# EasyEDA schematic sensor-shield-v5.json

## Sheets
1 Sensors: TITLE: Sheet_1; REV: 1.0; Date: 2022-08-30; Sheet: 1/1; Drawn By: lonelycorn; Company: Your Company
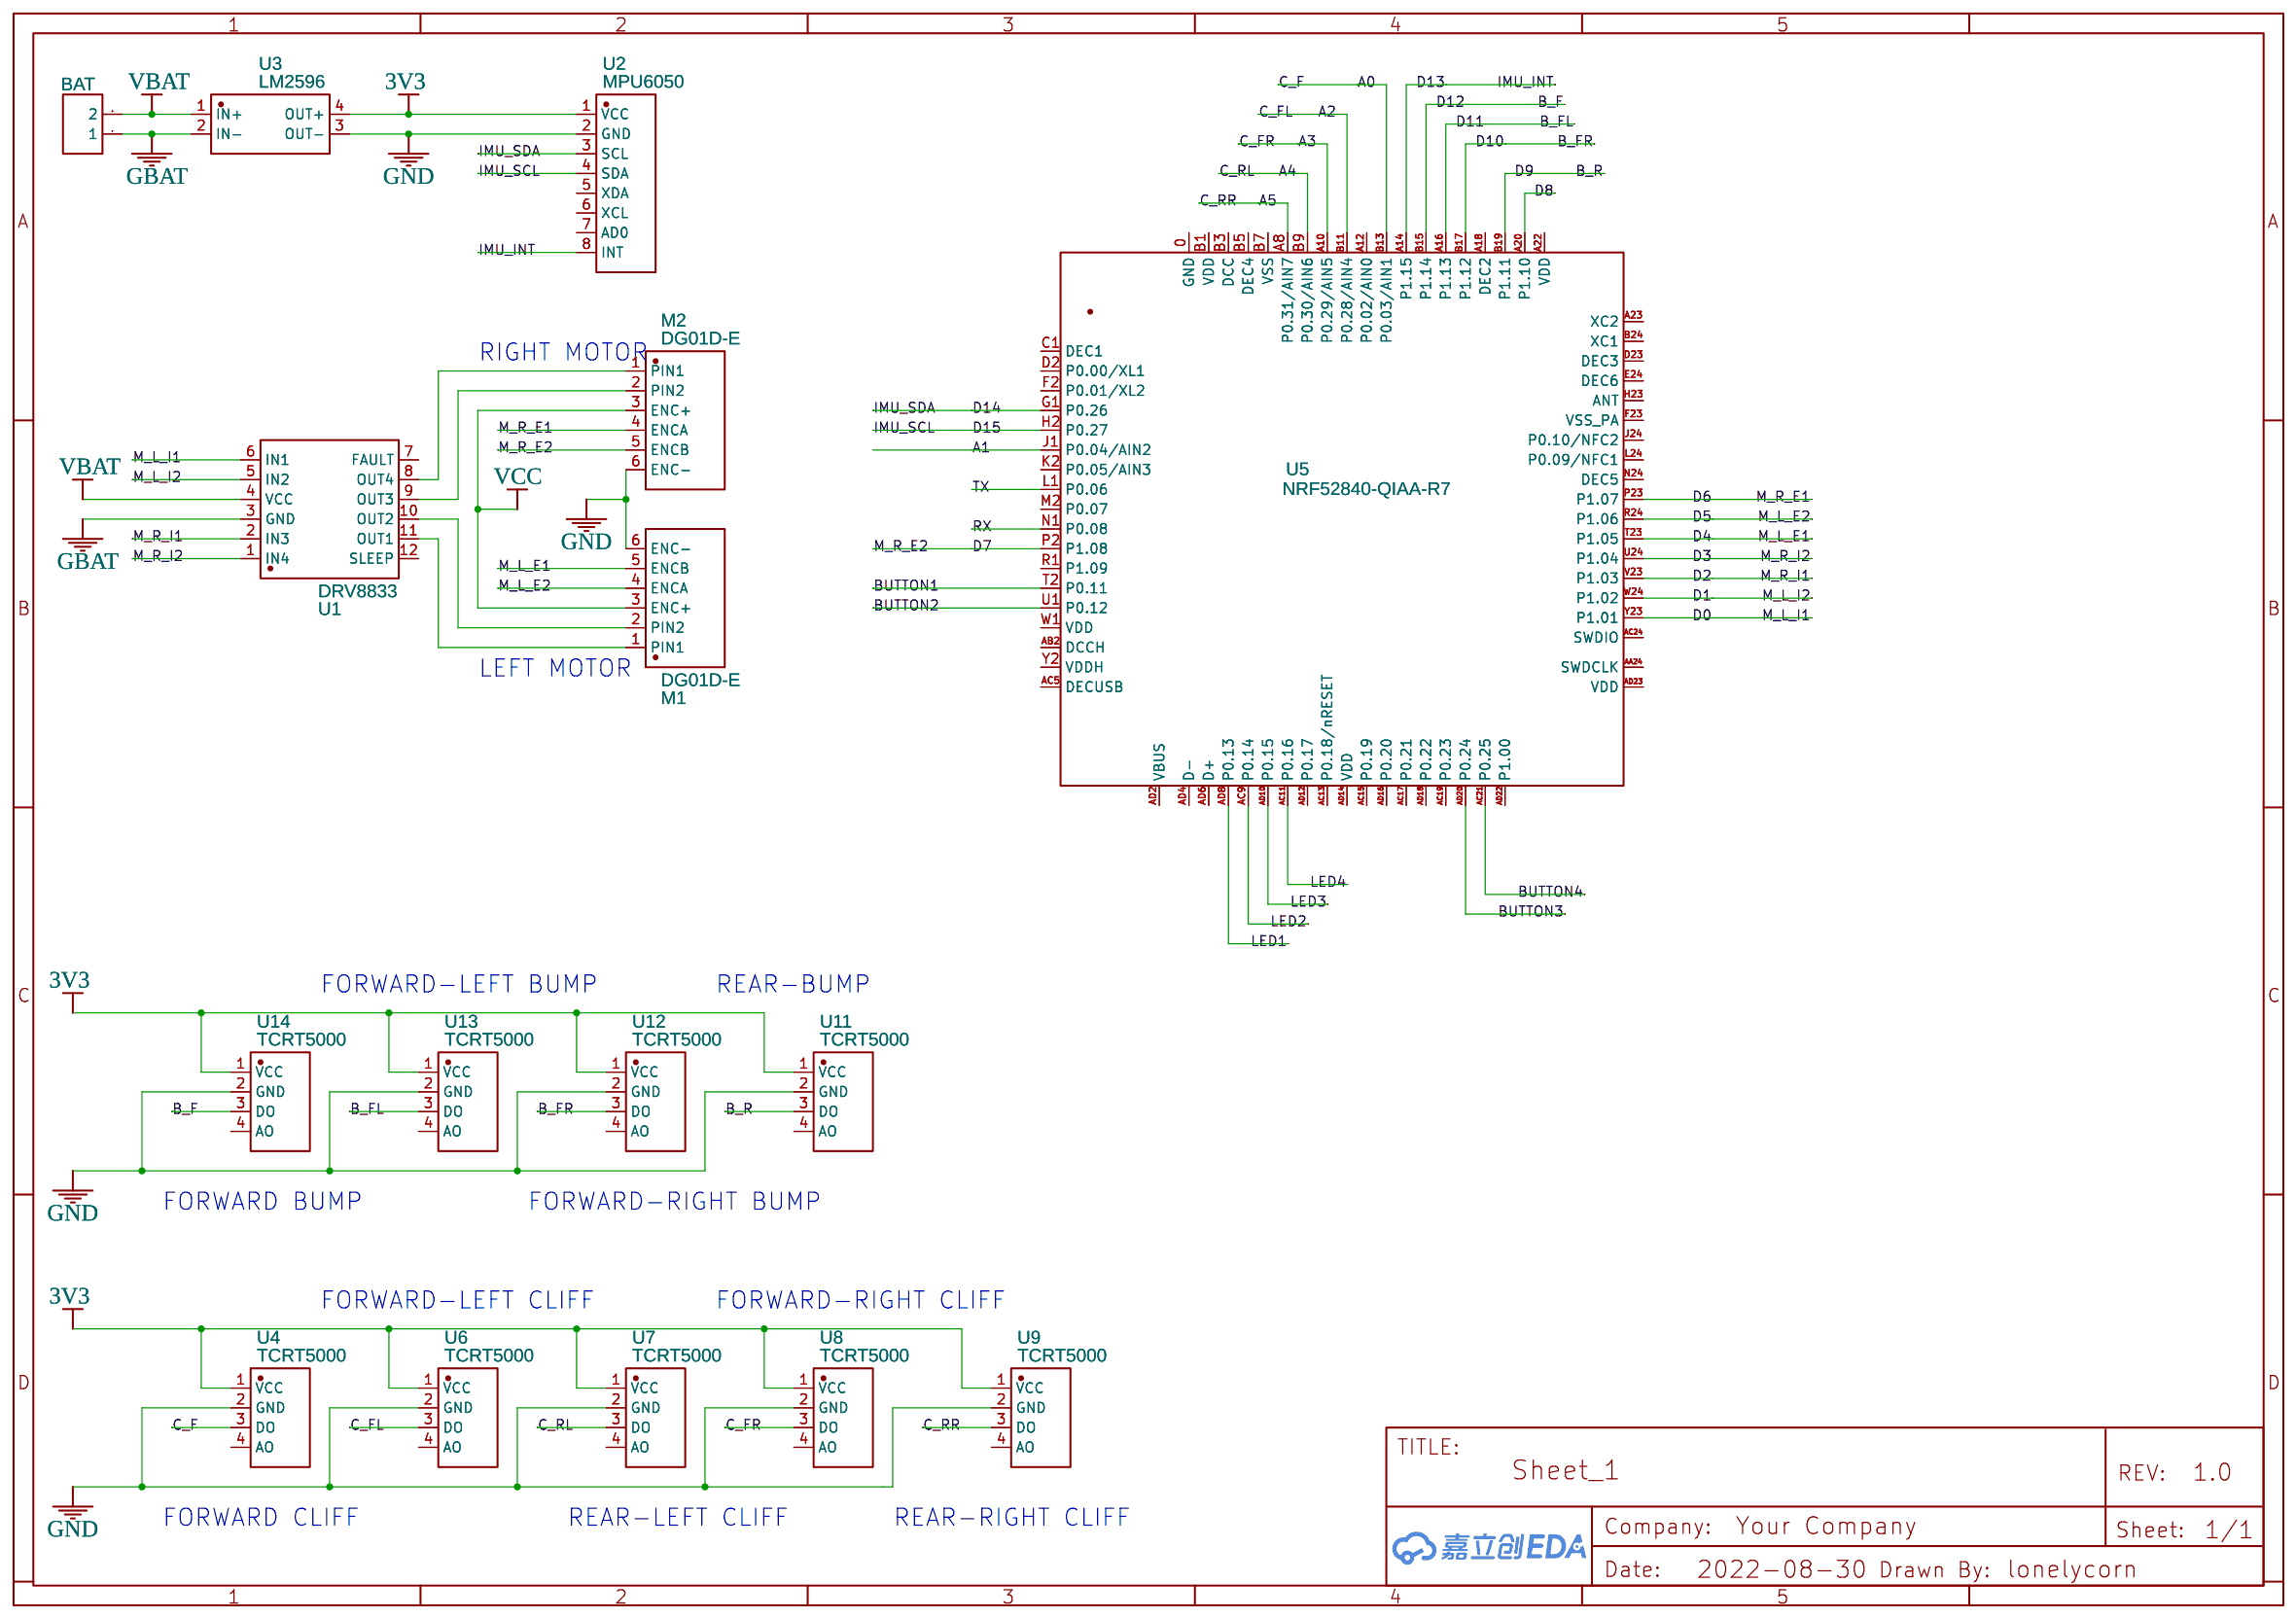
[diagram p0: Sensors]
2 Sensor Shield v5.0: TITLE: UNO Sensor Shield V5.0; Date: 2022-09-05
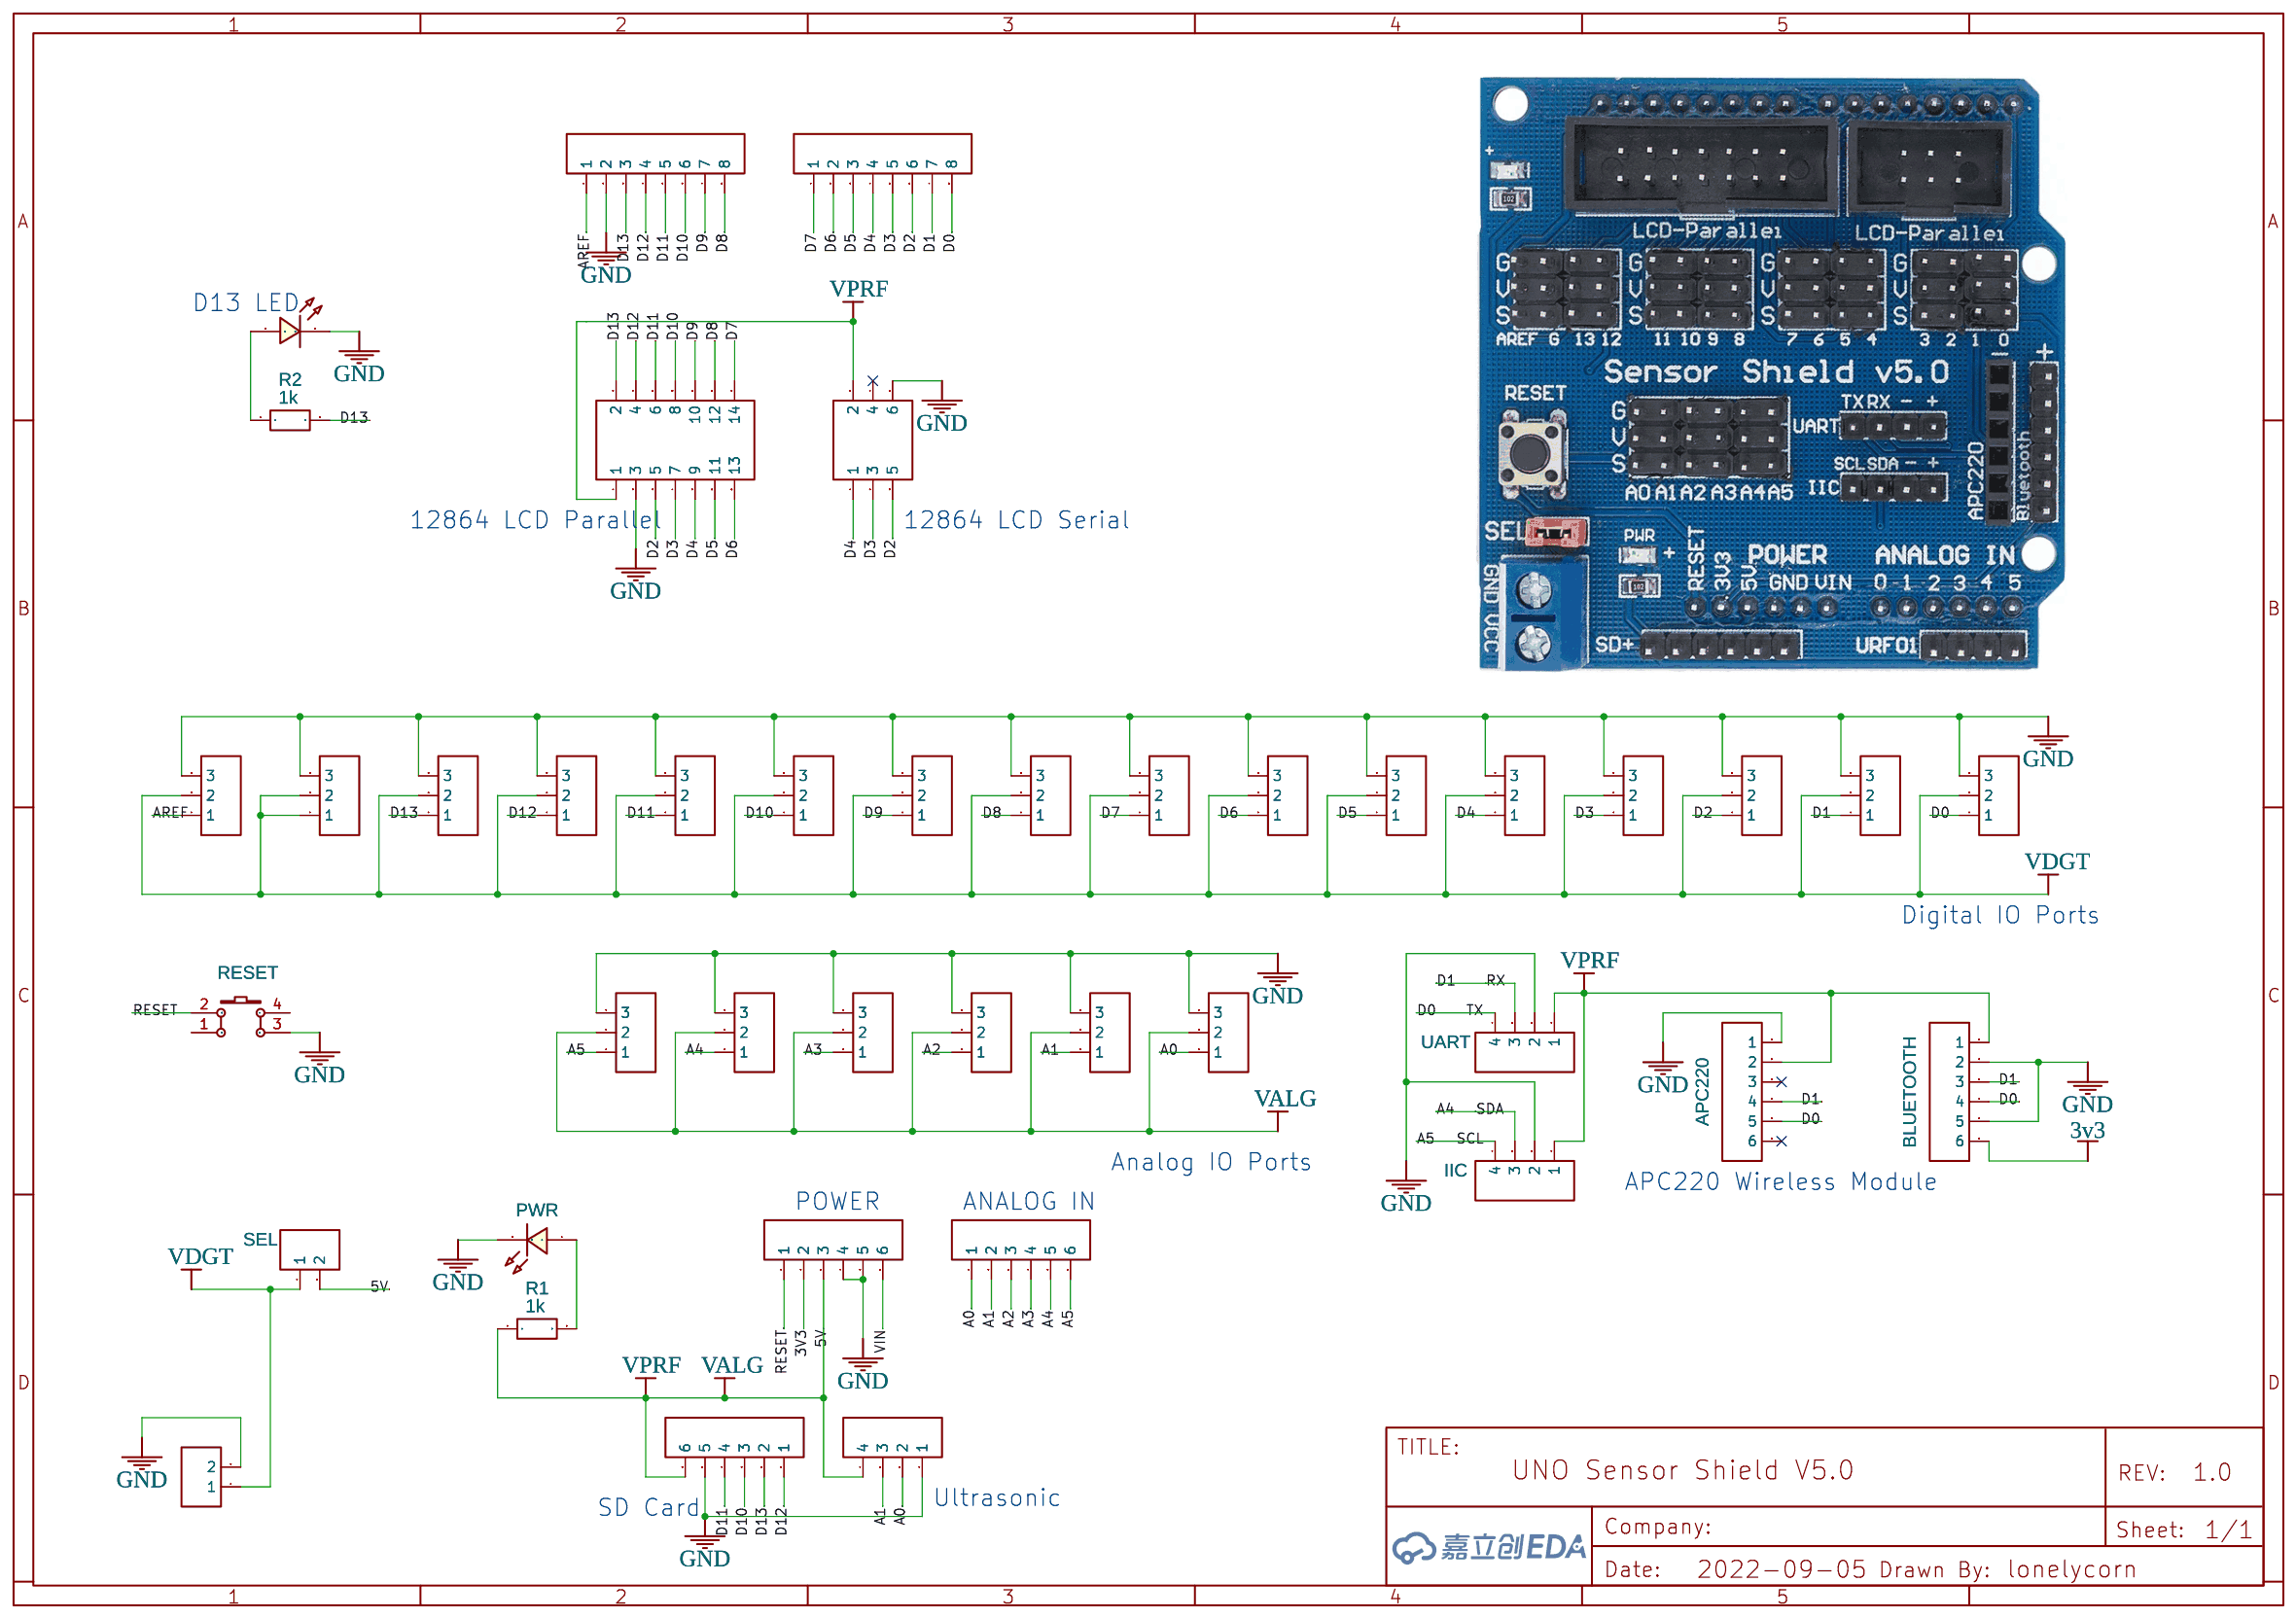
[diagram p1: Sensor Shield v5.0]

## Parts
sheet Sensor Shield v5.0
APC220  HDR-F-2.54_1x6  [HDR-F-2.54_1X6]
BLUETOOTH  HDR-M-2.54_1x6  [HDR-M-2.54_1X6]
D0  HDR-M-2.54_1x3  [HDR-M-2.54_1X3]
D1  HDR-M-2.54_1x3  [HDR-M-2.54_1X3]
D2  HDR-M-2.54_1x3  [HDR-M-2.54_1X3]
D3  HDR-M-2.54_1x3  [HDR-M-2.54_1X3]
D4  HDR-M-2.54_1x3  [HDR-M-2.54_1X3]
D5  HDR-M-2.54_1x3  [HDR-M-2.54_1X3]
D6  HDR-M-2.54_1x3  [HDR-M-2.54_1X3]
D7  HDR-M-2.54_1x3  [HDR-M-2.54_1X3]
D8  HDR-M-2.54_1x3  [HDR-M-2.54_1X3]
D9  HDR-M-2.54_1x3  [HDR-M-2.54_1X3]
D10  HDR-M-2.54_1x3  [HDR-M-2.54_1X3]
D11  HDR-M-2.54_1x3  [HDR-M-2.54_1X3]
D12  HDR-M-2.54_1x3  [HDR-M-2.54_1X3]
D13  HDR-M-2.54_1x3  [HDR-M-2.54_1X3]
D14  HDR-M-2.54_1x3  [HDR-M-2.54_1X3]
D15  HDR-M-2.54_1x3  [HDR-M-2.54_1X3]
D16  HDR-M-2.54_1x3  [HDR-M-2.54_1X3]
D17  HDR-M-2.54_1x3  [HDR-M-2.54_1X3]
D18  HDR-M-2.54_1x3  [HDR-M-2.54_1X3]
D19  HDR-M-2.54_1x3  [HDR-M-2.54_1X3]
H1  HDR-M-2.54_1x3  [HDR-M-2.54_1X3]
H2  HDR-M-2.54_1x3  [HDR-M-2.54_1X3]
H4  HDR-F-2.54_2x3  [HDR-F-2.54_2X3]
IIC  HDR-M-2.54_1x4  [HDR-M-2.54_1X4]
J1  HDR-M-2.54_1x8  [HDR-M-2.54_1X8]
J2  HDR-M-2.54_1x8  [HDR-M-2.54_1X8]
J3  HDR-M-2.54_1x6  [HDR-M-2.54_1X6]
J4  HDR-M-2.54_1x6  [HDR-M-2.54_1X6]
J5  HDR-M-2.54_1x6  [HDR-M-2.54_1X6]
J6  HDR-M-2.54_1x4  [HDR-M-2.54_1X4]
LCD  HDR-F-2.54_2x7  [HDR-F-2.54_2X7]
LED1  LED-0603_R  [LED0603_RED]
P1  CONN-TH_2P-P5.00  [CONN-TH_2P-P5.00]
PWR  LED-0603_R  [LED0603_RED]
R1  1k  [R0402]
R2  1k  [R0402]
RESET  K4-6×6_SMD  [KEY-SMD_4P-L6.0-W6.0-P3.90-LS10.0]
SEL  HDR-M-2.54_1x2  [HDR-M-2.54_1X2]
UART  HDR-M-2.54_1x4  [HDR-M-2.54_1X4]
sheet Sensors
BAT  HDR-F-2.54_1x2  [HDR-F-2.54_1X2]
M1  DG01D-E
M2  DG01D-E
U1  DRV8833
U2  MPU6050
U3  LM2596
U4  TCRT5000
U5  NRF52840-QIAA-R7  [AQFN-73_L7.0-W7.0-P0.50-BL-EP4.8]
U6  TCRT5000
U7  TCRT5000
U8  TCRT5000
U9  TCRT5000
U11  TCRT5000
U12  TCRT5000
U13  TCRT5000
U14  TCRT5000

## Library data of the parts
APC220 BLUETOOTH = HDR-F-2.54_1x6: Supplier Part: C40877; Supplier: LCSC; Contributor: LCEDA_Lib
D0-D19 H1 H2 = HDR-F-2.54_1x3: Supplier Part: C146690; Supplier: LCSC; Contributor: LCEDA_Lib
H4 = HDR-F-2.54_2x3: Supplier Part: C65114; Supplier: LCSC; Contributor: LCEDA_Lib
IIC UART = HDR-F-2.54_1x4: Supplier Part: C225501; Supplier: LCSC; Contributor: LCEDA_Lib
J1 J2 = HDR-M-2.54_1x8: Supplier Part: C190820; Supplier: LCSC; Contributor: LCEDA_Lib
J3-J5 = HDR-M-2.54_1x6: Supplier Part: C190819; Supplier: LCSC; Contributor: LCEDA_Lib
J6 = HDR-M-2.54_1x4: Supplier Part: C124378; Supplier: LCSC; Contributor: LCEDA_Lib
LCD = HDR-F-2.54_2x7: Supplier Part: C38844; Supplier: LCSC; Contributor: LCEDA_Lib
LED1 PWR = LED-0603_R: Manufacturer: EVERLIGHT(台湾亿光); Manufacturer Part: 19-217/R6C-AL1M2VY/3T; Supplier Part: C72044; Supplier: LCSC; Contributor: LCEDA_01
P1 = CONN-TH_2P-P5.00: Supplier: LCSC; Contributor: LCEDA_Lib
R1 R2 = R_0402_EU: Contributor: LCEDA_Lib
RESET = K4-6×6_SMD: Supplier Part: C191626; Supplier: LCSC; Manufacturer: 韩国韩荣; Manufacturer Part: K2-6639SP-D4SC-04; Contributor: LCEDA_Lib
SEL = HDR-M-2.54_1x2: Supplier Part: C124375; Supplier: LCSC; Contributor: LCEDA_Lib
BAT = HDR-F-2.54_1x2: Supplier Part: C49661; Supplier: LCSC; Contributor: LCEDA_Lib
M1 M2 = DG01D-E
U1 = DRV8833
U2 = MPU6050
U3 = LM2596
U4 U6-U9 U11-U14 = TCRT5000
U5 = NRF52840-QIAA-R7: Supplier: LCSC; Supplier Part: C1851953; Manufacturer: NORDIC; JLCPCB Part Class: Extended Part; Contributor: LCSC

## Nets
3V3: J3.2 U2.1(VCC) U3.4(OUT+) U4.1(VCC) U6.1(VCC) U7.1(VCC) U8.1(VCC) U9.1(VCC) U11.1(VCC) U12.1(VCC) U13.1(VCC) U14.1(VCC)
3v3: BLUETOOTH.6
5V: APC220.2 BLUETOOTH.1 D14.2 D15.2 D16.2 D17.2 D18.2 D19.2 H4.2 IIC.1 J3.3 J5.6 J6.4 LCD.1 R1.1 SEL.2 UART.1
GND: APC220.1 BLUETOOTH.2 BLUETOOTH.5 D0.3 D1.3 D2.3 D3.3 D4.3 D5.3 D6.3 D7.3 D8.3 D9.3 D10.3 D11.3 D12.3 D13.3 D14.3 D15.3 D16.3 D17.3 D18.3 D19.3 H1.3 H2.3 H4.6 IIC.2 J1.2 J3.4 J3.5 J5.5 J6.1 LCD.3 LED1.2 M1.6(ENC-) M2.6(ENC-) P1.2 PWR.2 RESET.3 U2.2(GND) U3.3(OUT-) U4.2(GND) U6.2(GND) U7.2(GND) U8.2(GND) U9.2(GND) U11.2(GND) U12.2(GND) U13.2(GND) U14.2(GND) UART.2
VBAT: BAT.2 U1.4(VCC) U3.1(IN+)
VCC: M1.3(ENC+) M2.3(ENC+)
VIN: J3.6
A0: D19.1 J4.1 J6.2 U4.3(DO) U5.B13(P0.03/AIN1)
A1: D18.1 J4.2 J6.3 U5.J1(P0.04/AIN2)
A2: D17.1 J4.3 U5.B11(P0.28/AIN4) U6.3(DO)
A3: D16.1 J4.4 U5.A10(P0.29/AIN5) U8.3(DO)
A4: D15.1 IIC.3 J4.5 U5.B9(P0.30/AIN6) U7.3(DO)
A5: D14.1 IIC.4 J4.6 U5.A8(P0.31/AIN7) U9.3(DO)
AREF: H2.1 J1.1
B_F: D12.1 J1.4 J5.1 LCD.4 U5.B15(P1.14) U14.3(DO)
B_FL: D11.1 J1.5 J5.4 LCD.6 U5.A16(P1.13) U13.3(DO)
B_FR: D10.1 J1.6 J5.3 LCD.8 U5.B17(P1.12) U12.3(DO)
B_R: D9.1 J1.7 LCD.10 U5.B19(P1.11) U11.3(DO)
BUTTON1: U5.T2(P0.11)
BUTTON2: U5.U1(P0.12)
BUTTON3: U5.AD20(P0.24)
BUTTON4: U5.AC21(P0.25)
D0: APC220.5 BLUETOOTH.4 D0.1 J2.8 U1.6(IN1) U5.L1(P0.06) U5.Y23(P1.01) UART.4
D1: APC220.4 BLUETOOTH.3 D1.1 J2.7 U1.5(IN2) U5.N1(P0.08) U5.W24(P1.02) UART.3
D2: D2.1 H4.5 J2.6 LCD.5 U1.2(IN3) U5.V23(P1.03)
D3: D3.1 H4.3 J2.5 LCD.7 U1.1(IN4) U5.U24(P1.04)
D4: D4.1 H4.1 J2.4 LCD.9 M1.5(ENCB) U5.T23(P1.05)
D5: D5.1 J2.3 LCD.11 M1.4(ENCA) U5.R24(P1.06)
D6: D6.1 J2.2 LCD.13 M2.4(ENCA) U5.P23(P1.07)
D7: D7.1 J2.1 LCD.14 M2.5(ENCB) U5.P2(P1.08)
D8: D8.1 J1.8 LCD.12 U5.A20(P1.10)
D13: D13.1 J1.3 J5.2 LCD.2 R2.2 U2.8(INT) U5.A14(P1.15)
D14: U2.3(SCL) U5.G1(P0.26)
D15: U2.4(SDA) U5.H2(P0.27)
GBAT: BAT.1 U1.3(GND) U3.2(IN-)
LED1: U5.AD8(P0.13)
LED2: U5.AC9(P0.14)
LED3: U5.AD10(P0.15)
LED4: U5.AC11(P0.16)
RESET: J3.1 RESET.2
VDGT: D0.2 D1.2 D2.2 D3.2 D4.2 D5.2 D6.2 D7.2 D8.2 D9.2 D10.2 D11.2 D12.2 D13.2 H1.1 H1.2 H2.2 P1.1 SEL.1
Net-(LED1-1): LED1.1 R2.1
Net-(M1-1): M1.1(PIN1) U1.11(OUT1)
Net-(M1-2): M1.2(PIN2) U1.10(OUT2)
Net-(M2-1): M2.1(PIN1) U1.8(OUT4)
Net-(M2-2): M2.2(PIN2) U1.9(OUT3)
Net-(PWR-1): PWR.1 R1.2

Not connected (* = marked no-connect by the designer): APC220 3* 6*; H4 4*; RESET 1 4; U1 7(FAULT) 12(SLEEP); U2 5(XDA) 6(XCL) 7(AD0); U4 4(AO); U5 0(GND) A12(P0.02/AIN0) A18(DEC2) A22(VDD) A23(XC2) AA24(SWDCLK) AB2(DCCH) AC5(DECUSB) AC13(P0.18/nRESET) AC15(P0.19) AC17(P0.21) AC19(P0.23) AC24(SWDIO) AD2(VBUS) AD4(D-) AD6(D+) AD12(P0.17) AD14(VDD) AD16(P0.20) AD18(P0.22) AD22(P1.00) AD23(VDD) B1(VDD) B3(DCC) B5(DEC4) B7(VSS) B24(XC1) C1(DEC1) D2(P0.00/XL1) D23(DEC3) E24(DEC6) F2(P0.01/XL2) F23(VSS_PA) H23(ANT) J24(P0.10/NFC2) K2(P0.05/AIN3) L24(P0.09/NFC1) M2(P0.07) N24(DEC5) R1(P1.09) W1(VDD) Y2(VDDH); U6 4(AO); U7 4(AO); U8 4(AO); U9 4(AO); U11 4(AO); U12 4(AO); U13 4(AO); U14 4(AO)

## Notes on the sheets
sheet 1
- RIGHT MOTOR
- LEFT MOTOR
- FORWARD-LEFT BUMP
- REAR-BUMP
- FORWARD BUMP
- FORWARD-RIGHT BUMP
- FORWARD-LEFT CLIFF
- FORWARD-RIGHT CLIFF
- FORWARD CLIFF
- REAR-LEFT CLIFF
- REAR-RIGHT CLIFF
sheet 2
- D13 LED
- 12864 LCD Parallel
- 12864 LCD Serial
- Digital IO Ports
- Analog IO Ports
- POWER
- ANALOG IN
- APC220 Wireless Module
- Ultrasonic
- SD Card
